# EAGLE design LPC_4TE_3.42taster4x2 (EAGLE 5.00)
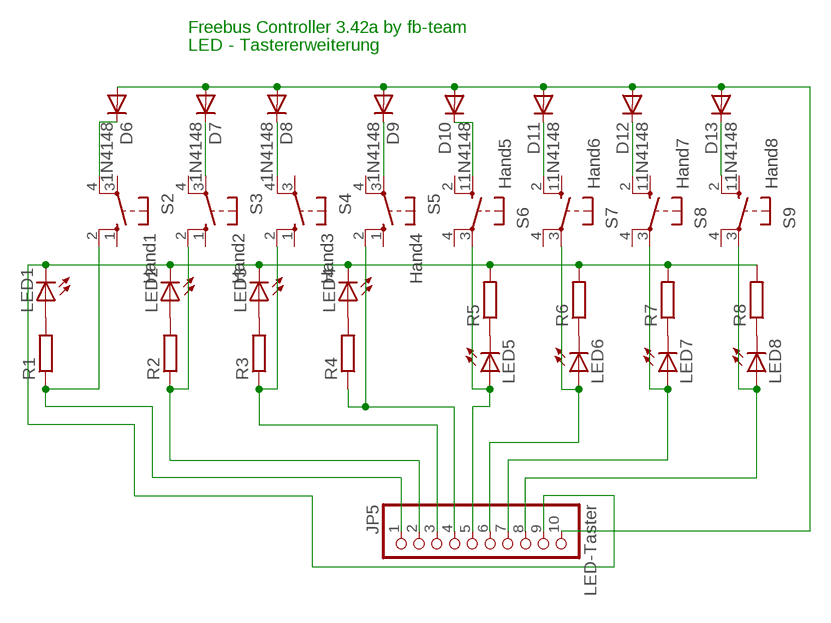
[diagram p0: schematic, sheet 1]

## Parts
D6  1N4148  [DO35-10]
D7  1N4148  [DO35-10]
D8  1N4148  [DO35-10]
D9  1N4148  [DO35-10]
D10  1N4148  [DO35-10]
D11  1N4148  [DO35-10]
D12  1N4148  [DO35-10]
D13  1N4148  [DO35-10]
JP5  LED-Taster  PINHD-1X10  [1X10]
LED1  LED3MM  [LED3MM]
LED2  LED3MM  [LED3MM]
LED3  LED3MM  [LED3MM]
LED4  LED3MM  [LED3MM]
LED5  LED3MM  [LED3MM]
LED6  LED3MM  [LED3MM]
LED7  LED3MM  [LED3MM]
LED8  LED3MM  [LED3MM]
R1  R-EU_0204/7  [0204/7]
R2  R-EU_0204/7  [0204/7]
R3  R-EU_0204/7  [0204/7]
R4  R-EU_0204/7  [0204/7]
R5  R-EU_0204/7  [0204/7]
R6  R-EU_0204/7  [0204/7]
R7  R-EU_0204/7  [0204/7]
R8  R-EU_0204/7  [0204/7]
S2  Hand1  10-XX  [B3F-10XX]
S3  Hand2  10-XX  [B3F-10XX]
S4  Hand3  10-XX  [B3F-10XX]
S5  Hand4  10-XX  [B3F-10XX]
S6  Hand5  10-XX  [B3F-10XX]
S7  Hand6  10-XX  [B3F-10XX]
S8  Hand7  10-XX  [B3F-10XX]
S9  Hand8  10-XX  [B3F-10XX]

## Nets
GND: JP5.9 LED1.K(C) LED2.K(C) LED3.K(C) LED4.K(C) R5.2 R6.2 R7.2 R8.2
N$1: D6.C S2.4(P1)
N$2: JP5.1 R1.1 S2.2(S1)
N$3: JP5.7 LED7.A S8.3(P)
N$4: D10.C S6.1(S)
N$5: D13.C S9.2(S1)
N$6: D8.C S4.4(P1)
N$7: D9.C S5.3(P)
N$9: D11.C S7.2(S1)
N$10: D12.C S8.2(S1)
N$11: D7.C S3.3(P)
N$12: JP5.5 LED5.A S6.3(P)
N$14: JP5.3 R3.1 S4.2(S1)
N$15: LED5.K(C) R5.1
N$16: LED6.K(C) R6.1
N$17: LED7.K(C) R7.1
N$18: LED8.K(C) R8.1
N$20: JP5.4 R4.1 S5.2(S1)
N$21: JP5.6 LED6.A S7.3(P)
N$22: LED1.A R1.2
N$23: LED2.A R2.2
N$24: JP5.8 LED8.A S9.3(P)
N$26: LED3.A R3.2
N$30: JP5.2 R2.1 S3.2(S1)
N$31: LED4.A R4.2
T_MUX: D6.A D7.A D8.A D9.A D10.A D11.A D12.A D13.A JP5.10
Unconnected: S2.1(S) S2.3(P) S3.1(S) S3.4(P1) S4.1(S) S4.3(P) S5.1(S) S5.4(P1) S6.2(S1) S6.4(P1) S7.1(S) S7.4(P1) S8.1(S) S8.4(P1) S9.1(S) S9.4(P1)

## Notes on the sheet
- Freebus Controller 3.42a by fb-team
- LED - Tastererweiterung

## Library data of the parts
D6-D13 = diode:1N4148: DIODE high speed (Philips)
JP5 = pinhead:PINHD-1X10: PIN HEADER
LED1-LED8 = led:LED: LED OSRAM: - CHIPLED LG R971, LG N971, LY N971, LG Q971, LY Q971, LO R971, LY R971 LH N974, LH R974 LS Q976, LO Q976, LY Q976 LO Q996 - Hyper CHIPLED LW Q18S LB Q993, LB Q99A, LB R99A - SideLED LS A670, LO A670, LY A670, LG A670, LP A670 LB A673, LV A673, LT A673, LW A673 LH A674 LY A675 LS A676, LA A676, LO A676, LY A676, LW A676 LS A679, LY A679, LG A679 - Hyper Micro SIDELED® LS Y876, LA Y876, LO Y876, LY Y876 LT Y87S - SmartLED LW L88C, LW L88S LB L89C, LB L89S, LG L890 LS L89K, LO L89K, LY L89K LS L896, LA L896, LO L896, LY L896 - TOPLED LS T670, LO T670, LY T670, LG T670, LP T670 LSG T670, LSP T670, LSY T670, LOP T670, LYG T670 LG T671, LOG T671, LSG T671 LB T673, LV T673, LT T673, LW T673 LH T674 LS T676, LA T676, LO T676, LY T676, LB T676, LH T676, LSB T676, LW T676 LB T67C, LV T67C, LT T67C, LS T67K, LO T67K, LY T67K, LW E67C LS E67B, LA E67B, LO E67B, LY E67B, LB E67C, LV E67C, LT E67C LW T67C LS T679, LY T679, LG T679 LS T770, LO T770, LY T770, LG T770, LP T770 LB T773, LV T773, LT T773, LW T773 LH T774 LS E675, LA E675, LY E675, LS T675 LS T776, LA T776, LO T776, LY T776, LB T776 LHGB T686 LT T68C, LB T68C - Hyper Mini TOPLED® LB M676 - Mini TOPLED Santana® LG M470 LS M47K, LO M47K, LY M47K Source: http://www.osram.convergy.de - LUMILED® LXK2-PW12-R00, LXK2-PW12-S00, LXK2-PW14-U00, LXK2-PW14-V00 LXK2-PM12-R00, LXK2-PM12-S00, LXK2-PM14-U00 LXK2-PE12-Q00, LXK2-PE12-R00, LXK2-PE12-S00, LXK2-PE14-T00, LXK2-PE14-U00 LXK2-PB12-K00, LXK2-PB12-L00, LXK2-PB12-M00, LXK2-PB14-N00, LXK2-PB14-P00, LXK2-PB14-Q00 LXK2-PR12-L00, LXK2-PR12-M00, LXK2-PR14-Q00, LXK2-PR14-R00 LXK2-PD12-Q00, LXK2-PD12-R00, LXK2-PD12-S00 LXK2-PH12-R00, LXK2-PH12-S00 LXK2-PL12-P00, LXK2-PL12-Q00, LXK2-PL12-R00 Source: www.luxeon.com
R1-R8 = rcl:R-EU_: RESISTOR, European symbol
S2-S9 = switch-omron:10-XX: OMRON SWITCH

## Board
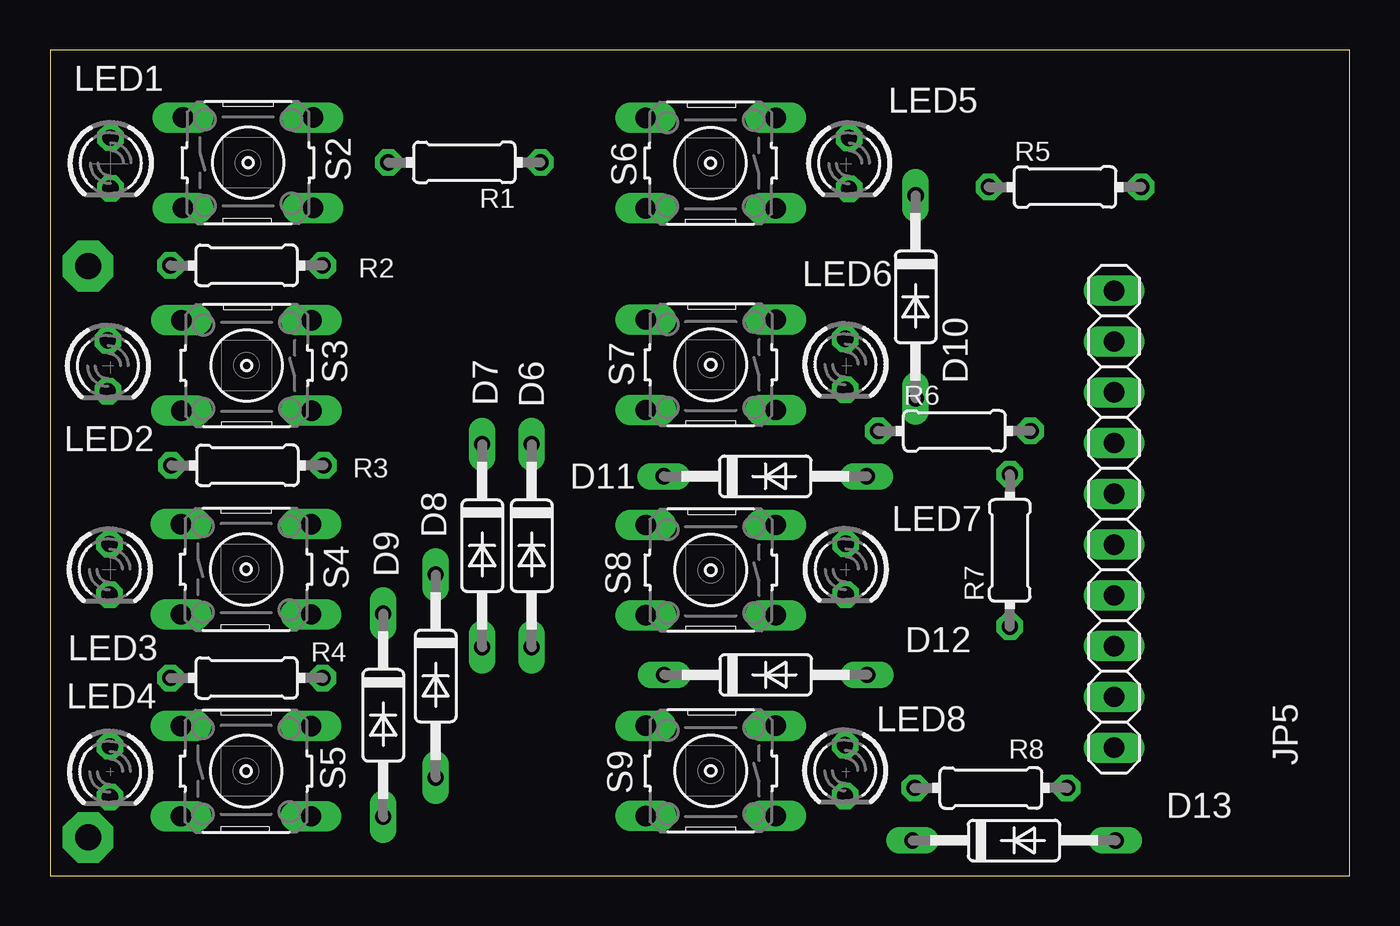
[diagram p1: board, top side]
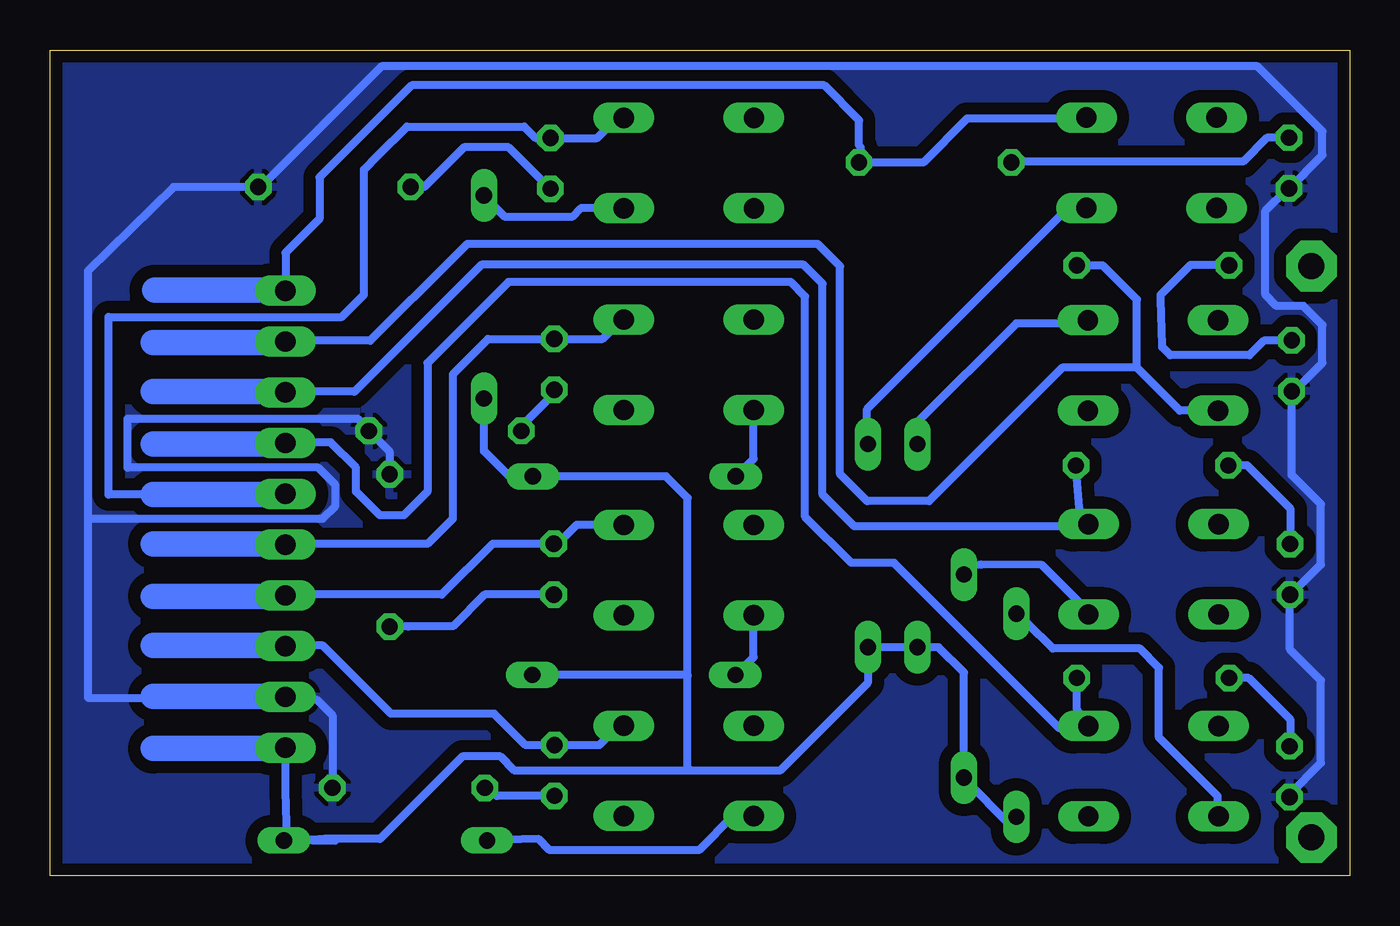
[diagram p2: board, bottom side, seen from below]

Size 65 x 41.3 mm. Coordinates in mm from the lower left corner, seen from the top.
Outline: 0,0 65,0 65,41.3 0,41.3 0,0
Copper layers (1*16): Top 0.035mm / dielectric 1.5mm / Bottom 0.035mm
Design rules "default *": minimum track width 10mil, minimum drill 24mil, track to track 12mil, track to pad 12mil, pad to pad 12mil, via to via 12mil, smd to smd 8mil, copper to edge 20mil, drill to drill 8mil, minimum pad ring 10mil, minimum via ring 8mil, stop-mask expansion 4mil, vias tented up to drill 0mil, thermal gap 10mil

### Footprints (pad centres in the part's own frame; a part is rotated, then mirrored left to right if it is on the bottom)
DO35-10 = drill 0.813 long: A 5.08,0; C -5.08,0
1X10 = drill 1.016 long: 1 -11.43,0; 2 -8.89,0; 3 -6.35,0; 4 -3.81,0; 5 -1.27,0; 6 1.27,0; 7 3.81,0; 8 6.35,0; 9 8.89,0; 10 11.43,0
LED3MM = drill 0.813 octagon: A -1.27,0; K 1.27,0
0204/7 = drill 0.813 octagon: 1 -3.81,0; 2 3.81,0
B3F-10XX = drill 1.016 long: 1 -3.251,2.261; 2 3.251,2.261; 3 -3.251,-2.261; 4 3.251,-2.261

### Placement (x,y rotation side)
D6  24.09,16.5 270 top
D7  21.62,16.5 270 top
D8  19.29,9.98 270 top
D9  16.67,8.02 270 top
D10  43.3,28.94 270 top
D11  35.78,19.97 0 top
D12  35.8,10.04 0 top
D13  48.22,1.75 0 top
JP5  53.22,17.82 270 top
LED1  3.03,35.64 270 top
LED2  2.89,25.5 270 top
LED3  2.98,15.31 270 top
LED4  3,5.2 270 top
LED5  39.97,35.63 270 top
LED6  39.78,25.57 270 top
LED7  39.8,15.32 270 top
LED8  39.77,5.25 270 top
R1  20.73,35.67 180 top
R2  9.83,30.52 180 top
R3  9.87,20.52 180 top
R4  9.83,9.88 180 top
R5  50.77,34.44 0 top
R6  45.24,22.24 0 top
R7  48.01,16.26 90 top
R8  47.06,4.38 0 top
S2  9.91,35.66 0 top
S3  9.83,25.52 180 top
S4  9.81,15.32 0 top
S5  9.81,5.22 0 top
S6  33.04,35.64 180 top
S7  33.05,25.55 180 top
S8  33.05,15.28 180 top
S9  33.05,5.24 180 top

### Tracks (layer width: path | path; a pad name or v marks a point on that pad's centre or on a via)
GND
  Bottom 0.406: R8.2 50.87,8.01 51.67,8.81 53.1,8.81 JP5.9 53.26,8.93 53.26,8.89 | R7.2 48.02,20.09 48.02,21.22 R6.2 49.05,22.3 49.61,22.86 61.12,22.86 61.12,20.4 51.59,20.4 50.72,19.53 50.72,18.5 51.36,17.86 63.1,17.86 | 63.1,17.86 63.1,30.24 58.83,34.44 54.68,34.44 54.61,34.37 54.58,34.4 R5.2 54.46,34.44 48.42,40.48 4.61,40.48 1.35,37.23 1.35,36.04 3.02,34.37 LED1.K 3.09,34.37 4.21,33.26 4.21,29.05 3.65,28.5 2.3,28.5 1.35,27.54 1.35,25.64 2.78,24.21 2.8,24.23 LED2.K 2.89,20.04 1.43,18.57 1.43,15.56 2.94,14.05 | 63.1,17.86 63.1,8.89 53.26,8.89 | 53.26,8.89 53.26,8.81 | LED3.K 2.98,11.31 1.43,9.76 1.43,5.64 3.02,4.05 3,4.03 LED4.K
  pour Bottom (isolate 0.61): -0.08,41.44 0.24,41.12 0.24,0.24 0.4,0.4 64.77,0.4 64.77,41.28
N$1
  Bottom 0.406: S2.4 13.24,33.4 13.26,33.42 13.34,33.34 14.13,33.34 24.13,23.34 24.13,21.59 24.12,21.58 D6.C
N$2
  Bottom 0.406: 13.16,38.44 S2.2 13.12,37.92 | JP5.1 53.22,31.16 51.52,32.86 51.52,34.93 46.91,39.53 26.27,39.53 24.53,37.78 24.53,36.51 24.45,36.43 24.46,36.43 R1.1 21.32,35.67 19.13,37.86 13.18,37.86 13.12,37.92 | 13.12,37.92 13.1,37.94
N$3
  Bottom 0.406: S8.3 38.66,17.54 39.61,16.59 LED7.A 42.86,16.59 45.4,14.05 53.26,14.05 JP5.7
N$4
  Bottom 0.406: S6.1 38.46,33.38 38.9,32.94 42.23,32.94 D10.C
N$5
  Bottom 0.406: S9.2 30.84,2.98 32.55,1.27 40.01,1.27 40.57,1.83 D13.C
N$6
  Bottom 0.406: 13.06,13.14 S4.4 13.06,13.22 15.38,15.54 18.42,15.56 18.87,15.48 D8.C
N$7
  Bottom 0.406: D9.C 16.11,12.62 14.84,11.35 10.48,11.35 9.53,10.4 9.53,6.91 6.59,3.97 6.57,3.44 S5.3
N$8
  Bottom 1.27: 53.26,29.29 59.77,29.29
N$9
  Bottom 0.406: D11.C 30.67,19.97 29.8,20.84 S7.2
N$10
  Bottom 0.406: D12.C 30.68,10.04 29.8,10.92 S8.2
N$11
  Bottom 0.406: S3.3 13.17,27.78 13.26,27.86 13.5,27.62 16.67,27.62 21.62,22.68 D7.C
N$12
  Bottom 0.406: S6.3 36.55,37.9 36.59,37.94 37.64,36.9 LED5.A 40.71,36.9 41.28,37.47 47.15,37.47 48.58,36.04 49.29,35.32 49.29,29.05 50.4,27.94 62.07,27.94 62.07,19.05 59.85,19.05 | JP5.5 53.18,19.05 53.26,19.05
  Bottom 1.27: 53.26,19.05 59.85,19.05
N$13
  Bottom 1.27: 53.26,21.59 59.85,21.59
N$14
  Bottom 0.406: 13.22,17.58 13.26,17.54 | 13.22,17.58 S4.2 13.18,17.7 12.94,17.46 24.77,17.46 26.35,19.05 26.35,29.61 27.31,30.56 43.42,30.56 49.77,24.21 53.18,24.21 | R3.1 13.52,18.39 13.22,17.58 | 53.18,24.21 JP5.3 53.18,24.21 | 53.18,24.21 53.1,24.13
N$15
  Bottom 0.406: 40.31,34.36 LED5.K 39.99,34.36 42.07,36.43 44.29,36.43 46.28,34.44 R5.1
N$16
  Bottom 0.406: R6.1 41.29,22.64 41.28,22.62 39.78,24.12 LED6.K
N$17
  Bottom 0.406: LED7.K 43.26,14.05 44.85,12.46 46.91,12.46 47.08,12.45 R7.1
N$18
  Bottom 0.406: R8.1 42.8,4.14 42.64,3.98 LED8.K
N$19
  Bottom 1.27: 53.26,24.21 59.85,24.21 | 59.85,24.21
N$20
  Bottom 0.406: S5.2 13.08,7.46 | 13.06,7.34 13.1,7.3 | S5.2 13.06,7.34 | R4.1 13.64,8.35 13.06,7.34 | S5.2 13.06,7.5 13.18,7.62 13.26,7.54 | S5.2 13.16,7.48 13.26,7.38 14.53,7.38 22.78,15.64 24.92,15.64 27.23,17.94 27.23,28.97 27.94,29.69 42.07,29.69 46.12,25.64 46.12,19.21 47.31,18.02 48.5,18.02 49.69,19.21 49.69,20.4 50.96,21.67 53.18,21.67 JP5.4
N$21
  Bottom 0.406: LED6.A 39.77,26.83 | LED6.A 37.37,26.84 36.41,27.81 S7.3 | LED6.A 43.09,26.84 44.85,25.08 44.85,17.86 46.12,16.59 53.18,16.59 JP5.6
  Bottom 1.27: 53.18,16.59 59.85,16.59
N$22
  Bottom 0.406: R1.2 16.8,35.67 16.67,35.8 16.51,35.72 5.32,35.72 4.13,36.91 3.02,36.91 LED1.A
N$23
  Bottom 0.406: 6.02,30.63 6.03,30.64 | 6.02,30.63 R2.2 | 5.95,30.56 7.94,30.56 9.45,29.05 9.45,28.81 9.37,26.51 9.37,26.43 8.97,26.04 5,26.04 4.29,26.75 2.94,26.75 2.92,26.77 LED2.A | 5.95,30.56 | 5.95,30.56 6.02,30.63
N$24
  Bottom 0.406: S9.3 36.56,7.5 37.53,6.52 LED8.A 41.21,6.52 42.78,8.1 47.94,8.1 51.36,11.51 53.18,11.51 JP5.8
  Bottom 1.27: 53.18,11.51 59.85,11.51
N$25
  Bottom 1.27: 53.26,26.67 59.85,26.67
N$26
  Bottom 0.406: R3.2 5.12,20.52 2.94,18.34 2.94,16.75 2.98,16.71 LED3.A
N$27  (via drill 1.3 pad 2.54)
  other vias: 1.9,30.48
N$28  (via drill 1.3 pad 2.54)
  other vias: 1.9,1.9
N$29
  Bottom 1.27: 53.18,13.97 59.85,13.97
N$30
  Bottom 0.406: JP5.2 53.18,26.75 48.98,26.75 44.77,30.96 44.13,31.59 26.59,31.59 25.48,30.48 25.48,20.08 24.13,18.73 21.04,18.73 14.37,25.4 10.64,25.4 | 13.68,30.56 R2.1 12.34,30.52 10.64,28.81 10.64,25.4 | S3.2 6.59,23.25 8.49,23.26 10.64,25.4 | 10.64,25.4
N$31
  Bottom 0.406: R4.2 5.04,9.88 2.94,7.78 2.94,6.43 2.97,6.46 LED4.A
N$33
  Bottom 1.27: 53.26,8.97 59.85,8.97
N$35
  Bottom 1.27: 53.18,6.35 59.85,6.35
T_MUX
  Bottom 0.406: 53.14,1.78 50.72,1.75 | 53.14,1.78 D13.A 50.73,1.83 51.28,1.83 48.5,1.83 44.37,5.95 42.47,5.95 41.75,5.24 33.02,5.24 | JP5.10 53.22,4.25 53.14,1.78 | 33.02,5.24 28.5,5.24 24.09,9.65 D6.A 23.98,11.42 23.97,11.43 23.96,11.42 20.55,11.42 | 33.02,5.24 33.02,5.32 33.1,5.4 33.1,10 | 33.1,10 33.1,18.89 34.18,19.97 D11.A 40.88,20 42.07,20 43.3,21.23 D10.A | D12.A 33.14,10.04 33.1,10 | 19.35,4.9 19.53,5.08 | 19.35,4.9 D8.A 19.29,10.16 20.55,11.42 | D9.A 16.83,2.38 19.35,4.9 | 20.55,11.42 21.83,11.43 | 20.55,11.42 D7.A